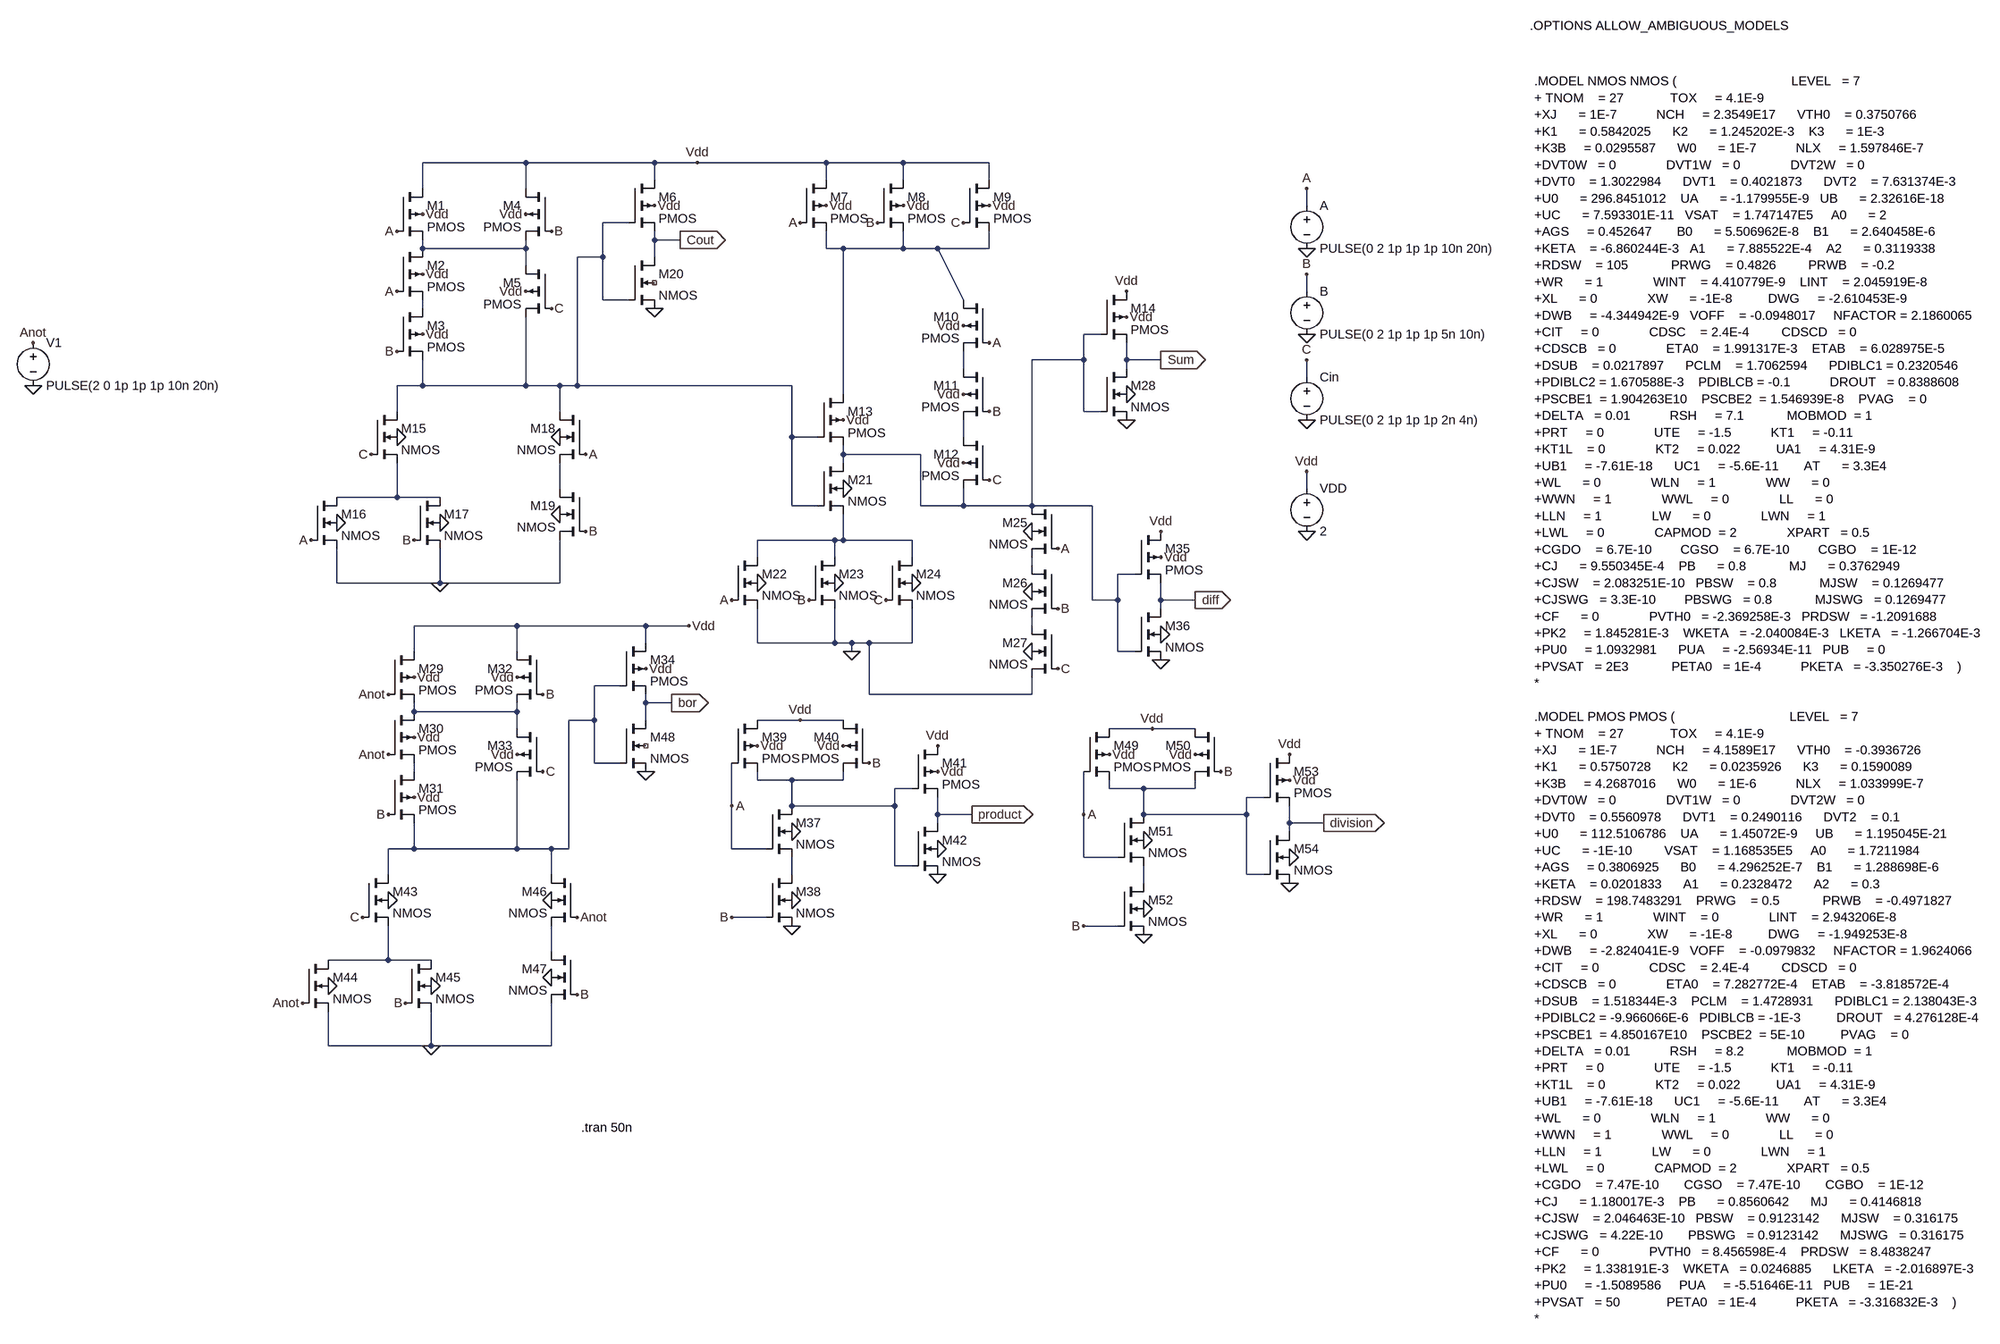
[diagram p0: schematic VLSIProjectfinal.asc]
VLSIProjectfinal.asc, the LTspice schematic file:
Version 4.1
SHEET 1 5960 2140
WIRE 224 -32 32 -32
WIRE 464 -32 224 -32
WIRE 544 -32 464 -32
WIRE 784 -32 544 -32
WIRE 928 -32 784 -32
WIRE 1088 -32 928 -32
WIRE 464 0 464 -32
WIRE 784 0 784 -32
WIRE 928 0 928 -32
WIRE 1088 0 1088 -32
WIRE 32 16 32 -32
WIRE 224 16 224 -32
WIRE 1680 48 1680 16
WIRE 416 80 368 80
WIRE 464 112 464 96
WIRE 512 112 464 112
WIRE 32 128 32 112
WIRE 224 128 224 112
WIRE 224 128 32 128
WIRE 784 128 784 96
WIRE 816 128 784 128
WIRE 928 128 928 96
WIRE 928 128 816 128
WIRE 992 128 928 128
WIRE 1088 128 1088 96
WIRE 1088 128 992 128
WIRE 368 144 368 80
WIRE 368 144 320 144
WIRE 464 144 464 112
WIRE 224 160 224 128
WIRE 1680 208 1680 176
WIRE 368 224 368 144
WIRE 416 224 368 224
WIRE 1040 224 992 128
WIRE 32 240 32 224
WIRE 1296 288 1264 288
WIRE 1264 336 1264 288
WIRE 1264 336 1168 336
WIRE 1344 336 1344 304
WIRE 1408 336 1344 336
WIRE 1040 352 1040 320
WIRE 1344 352 1344 336
WIRE 1680 368 1680 336
WIRE 32 384 32 336
WIRE 32 384 -16 384
WIRE 224 384 224 256
WIRE 224 384 32 384
WIRE 288 384 224 384
WIRE 320 384 320 144
WIRE 320 384 288 384
WIRE 720 384 320 384
WIRE 816 400 816 128
WIRE -16 432 -16 384
WIRE 288 432 288 384
WIRE 1264 432 1264 336
WIRE 1296 432 1264 432
WIRE 720 480 720 384
WIRE 768 480 720 480
WIRE 1040 480 1040 448
WIRE 816 512 816 496
WIRE 960 512 816 512
WIRE 816 528 816 512
WIRE 288 576 288 528
WIRE 1680 576 1680 544
WIRE -16 592 -16 528
WIRE -16 592 -128 592
WIRE 64 592 -16 592
WIRE 720 608 720 480
WIRE 768 608 720 608
WIRE 960 608 960 512
WIRE 1040 608 1040 576
WIRE 1040 608 960 608
WIRE 1168 608 1168 336
WIRE 1168 608 1040 608
WIRE 1280 608 1168 608
WIRE 800 672 656 672
WIRE 816 672 816 624
WIRE 816 672 800 672
WIRE 944 672 816 672
WIRE 656 704 656 672
WIRE 800 704 800 672
WIRE 944 704 944 672
WIRE 1168 720 1168 704
WIRE 1360 736 1328 736
WIRE -128 752 -128 688
WIRE 64 752 64 688
WIRE 64 752 -128 752
WIRE 288 752 288 672
WIRE 288 752 64 752
WIRE 1280 784 1280 608
WIRE 1328 784 1328 736
WIRE 1328 784 1280 784
WIRE 1408 784 1408 752
WIRE 1472 784 1408 784
WIRE 1408 800 1408 784
WIRE 208 832 16 832
WIRE 448 832 208 832
WIRE 528 832 448 832
WIRE 1168 832 1168 816
WIRE 448 864 448 832
WIRE 656 864 656 800
WIRE 800 864 800 800
WIRE 800 864 656 864
WIRE 832 864 800 864
WIRE 864 864 832 864
WIRE 944 864 944 800
WIRE 944 864 864 864
WIRE 16 880 16 832
WIRE 208 880 208 832
WIRE 832 880 832 864
WIRE 1328 880 1328 784
WIRE 1360 880 1328 880
WIRE 400 944 352 944
WIRE 864 960 864 864
WIRE 1168 960 1168 928
WIRE 1168 960 864 960
WIRE 448 976 448 960
WIRE 496 976 448 976
WIRE 16 992 16 976
WIRE 208 992 208 976
WIRE 208 992 16 992
WIRE 352 1008 352 944
WIRE 352 1008 304 1008
WIRE 448 1008 448 976
WIRE 736 1008 656 1008
WIRE 816 1008 736 1008
WIRE 208 1024 208 992
WIRE 1392 1024 1312 1024
WIRE 1472 1024 1392 1024
WIRE 352 1088 352 1008
WIRE 400 1088 352 1088
WIRE 16 1104 16 1088
WIRE 656 1120 656 1104
WIRE 720 1120 656 1120
WIRE 816 1120 816 1104
WIRE 816 1120 720 1120
WIRE 944 1136 912 1136
WIRE 1312 1136 1312 1120
WIRE 1376 1136 1312 1136
WIRE 1472 1136 1472 1120
WIRE 1472 1136 1376 1136
WIRE 1600 1152 1568 1152
WIRE 608 1168 608 1088
WIRE 720 1168 720 1120
WIRE 912 1168 912 1136
WIRE 912 1168 720 1168
WIRE 992 1184 992 1152
WIRE 1056 1184 992 1184
WIRE 1264 1184 1264 1104
WIRE 1376 1184 1376 1136
WIRE 1568 1184 1568 1152
WIRE 1568 1184 1376 1184
WIRE 992 1200 992 1184
WIRE 1648 1200 1648 1168
WIRE 1712 1200 1648 1200
WIRE 1648 1216 1648 1200
WIRE 16 1248 16 1200
WIRE 16 1248 -32 1248
WIRE 208 1248 208 1120
WIRE 208 1248 16 1248
WIRE 272 1248 208 1248
WIRE 304 1248 304 1008
WIRE 304 1248 272 1248
WIRE 608 1248 608 1168
WIRE 672 1248 608 1248
WIRE 1264 1264 1264 1184
WIRE 1328 1264 1264 1264
WIRE 912 1280 912 1168
WIRE 944 1280 912 1280
WIRE -32 1296 -32 1248
WIRE 272 1296 272 1248
WIRE 720 1296 720 1264
WIRE 1568 1296 1568 1184
WIRE 1600 1296 1568 1296
WIRE 1376 1312 1376 1280
WIRE 672 1376 608 1376
WIRE 1328 1392 1264 1392
WIRE 272 1440 272 1392
WIRE -32 1456 -32 1392
WIRE -32 1456 -144 1456
WIRE 48 1456 -32 1456
WIRE -144 1616 -144 1552
WIRE 48 1616 48 1552
WIRE 48 1616 -144 1616
WIRE 272 1616 272 1536
WIRE 272 1616 48 1616
FLAG 1344 448 0
FLAG 64 752 0
FLAG 464 240 0
FLAG 832 880 0
FLAG 1680 128 0
FLAG 1680 288 0
FLAG 1680 448 0
FLAG 1680 656 0
FLAG 1680 544 Vdd
FLAG 544 -32 Vdd
FLAG 1344 208 Vdd
FLAG 32 64 Vdd
FLAG 224 64 Vdd
FLAG 32 176 Vdd
FLAG 224 208 Vdd
FLAG 32 288 Vdd
FLAG 464 48 Vdd
FLAG 784 48 Vdd
FLAG 928 48 Vdd
FLAG 1088 48 Vdd
FLAG 1040 272 Vdd
FLAG 1040 400 Vdd
FLAG 816 448 Vdd
FLAG 1040 528 Vdd
FLAG 1344 256 Vdd
FLAG 1680 16 A
FLAG -16 96 A
FLAG -16 208 A
FLAG -176 672 A
FLAG 336 512 A
FLAG 736 80 A
FLAG 1088 304 A
FLAG 608 784 A
FLAG 1216 688 A
FLAG 1680 176 B
FLAG -16 320 B
FLAG 272 96 B
FLAG 16 672 B
FLAG 336 656 B
FLAG 880 80 B
FLAG 1088 432 B
FLAG 752 784 B
FLAG 1216 800 B
FLAG 1680 336 C
FLAG -64 512 C
FLAG 272 240 C
FLAG 1040 80 C
FLAG 1088 560 C
FLAG 896 784 C
FLAG 1216 912 C
FLAG 1408 336 Sum
IOPIN 1408 336 Out
FLAG 512 112 Cout
IOPIN 512 112 Out
FLAG -16 480 0
FLAG 288 480 0
FLAG -128 640 0
FLAG 64 640 0
FLAG 288 624 0
FLAG 816 576 0
FLAG 656 752 0
FLAG 800 752 0
FLAG 944 752 0
FLAG 1168 656 0
FLAG 1168 880 0
FLAG 1168 768 0
FLAG 1344 400 0
FLAG -704 384 0
FLAG -704 304 Anot
FLAG 48 1616 0
FLAG 448 1104 0
FLAG 528 832 Vdd
FLAG 16 928 Vdd
FLAG 208 928 Vdd
FLAG 16 1040 Vdd
FLAG 208 1072 Vdd
FLAG 16 1152 Vdd
FLAG 448 912 Vdd
FLAG -32 1184 B
FLAG 256 960 B
FLAG 0 1536 B
FLAG 320 1520 B
FLAG -80 1376 C
FLAG 256 1104 C
FLAG 496 976 bor
IOPIN 496 976 Out
FLAG -32 1344 0
FLAG 272 1344 0
FLAG -144 1504 0
FLAG 48 1504 0
FLAG 272 1488 0
FLAG -32 960 Anot
FLAG -32 1072 Anot
FLAG -192 1536 Anot
FLAG 320 1376 Anot
FLAG 1408 896 0
FLAG 1408 656 Vdd
FLAG 1408 704 Vdd
FLAG 1472 784 diff
IOPIN 1472 784 Out
FLAG 1408 848 0
FLAG 720 1392 0
FLAG 736 1008 Vdd
FLAG 720 1216 0
FLAG 720 1344 0
FLAG 656 1056 Vdd
FLAG 816 1056 Vdd
FLAG 608 1376 B
FLAG 864 1088 B
FLAG 608 1168 A
FLAG 992 1296 0
FLAG 992 1056 Vdd
FLAG 992 1104 Vdd
FLAG 1056 1184 product
IOPIN 1056 1184 Out
FLAG 992 1248 0
FLAG 1376 1408 0
FLAG 1392 1024 Vdd
FLAG 1376 1232 0
FLAG 1376 1360 0
FLAG 1312 1072 Vdd
FLAG 1472 1072 Vdd
FLAG 1264 1392 B
FLAG 1520 1104 B
FLAG 1264 1184 A
FLAG 1648 1312 0
FLAG 1648 1072 Vdd
FLAG 1648 1120 Vdd
FLAG 1712 1200 division
IOPIN 1712 1200 Out
FLAG 1648 1264 0
SYMBOL pmos4 -16 16 R0
SYMATTR InstName M1
SYMATTR Value2 l=180n w=180n
SYMBOL pmos4 -16 128 R0
SYMATTR InstName M2
SYMATTR Value2 l=180n w=180n
SYMBOL pmos4 -16 240 R0
SYMATTR InstName M3
SYMATTR Value2 l=180n w=180n
SYMBOL pmos4 272 16 M0
SYMATTR InstName M4
SYMATTR Value2 l=180n w=180n
SYMBOL pmos4 272 160 M0
SYMATTR InstName M5
SYMATTR Value2 l=180n w=180n
SYMBOL pmos4 416 0 R0
SYMATTR InstName M6
SYMATTR Value2 l=180n w=180n
SYMBOL pmos4 736 0 R0
SYMATTR InstName M7
SYMATTR Value2 l=180n w=180n
SYMBOL pmos4 880 0 R0
SYMATTR InstName M8
SYMATTR Value2 l=180n w=180n
SYMBOL pmos4 1040 0 R0
SYMATTR InstName M9
SYMATTR Value2 l=180n w=180n
SYMBOL pmos4 1088 224 M0
SYMATTR InstName M10
SYMATTR Value2 l=180n w=180n
SYMBOL pmos4 1088 352 M0
SYMATTR InstName M11
SYMATTR Value2 l=180n w=180n
SYMBOL pmos4 1088 480 M0
SYMATTR InstName M12
SYMATTR Value2 l=180n w=180n
SYMBOL pmos4 768 400 R0
SYMATTR InstName M13
SYMATTR Value2 l=180n w=180n
SYMBOL pmos4 1296 208 R0
SYMATTR InstName M14
SYMATTR Value2 l=180n w=180n
SYMBOL nmos4 -64 432 R0
SYMATTR InstName M15
SYMATTR Value2 l=180n w=180n
SYMBOL nmos4 -176 592 R0
SYMATTR InstName M16
SYMATTR Value2 l=180n w=180n
SYMBOL nmos4 16 592 R0
SYMATTR InstName M17
SYMATTR Value2 l=180n w=180n
SYMBOL nmos4 336 432 M0
SYMATTR InstName M18
SYMATTR Value2 l=180n w=180n
SYMBOL nmos4 336 576 M0
SYMATTR InstName M19
SYMATTR Value2 l=180n w=180n
SYMBOL nmos4 416 144 R0
SYMATTR InstName M20
SYMATTR Value2 l=180n w=180n
SYMBOL nmos4 768 528 R0
SYMATTR InstName M21
SYMATTR Value2 l=180n w=180n
SYMBOL nmos4 608 704 R0
SYMATTR InstName M22
SYMATTR Value2 l=180n w=180n
SYMBOL nmos4 752 704 R0
SYMATTR InstName M23
SYMATTR Value2 l=180n w=180n
SYMBOL nmos4 896 704 R0
SYMATTR InstName M24
SYMATTR Value2 l=180n w=180n
SYMBOL nmos4 1216 608 M0
SYMATTR InstName M25
SYMATTR Value2 l=180n w=180n
SYMBOL nmos4 1216 720 M0
SYMATTR InstName M26
SYMATTR Value2 l=180n w=180n
SYMBOL nmos4 1216 832 M0
SYMATTR InstName M27
SYMATTR Value2 l=180n w=180n
SYMBOL nmos4 1296 352 R0
SYMATTR InstName M28
SYMATTR Value2 l=180n w=180n
SYMBOL voltage 1680 32 R0
WINDOW 123 0 0 Left 0
WINDOW 39 0 0 Left 0
SYMATTR InstName A
SYMATTR Value PULSE(0 2 1p 1p 1p 10n 20n)
SYMBOL voltage 1680 192 R0
WINDOW 123 0 0 Left 0
WINDOW 39 0 0 Left 0
SYMATTR InstName B
SYMATTR Value PULSE(0 2 1p 1p 1p 5n 10n)
SYMBOL voltage 1680 352 R0
WINDOW 123 0 0 Left 0
WINDOW 39 0 0 Left 0
SYMATTR InstName Cin
SYMATTR Value PULSE(0 2 1p 1p 1p 2n 4n)
SYMBOL voltage 1680 560 R0
WINDOW 123 0 0 Left 0
WINDOW 39 0 0 Left 0
SYMATTR InstName VDD
SYMATTR Value 2
SYMBOL voltage -704 288 R0
WINDOW 123 0 0 Left 0
WINDOW 39 0 0 Left 0
SYMATTR InstName V1
SYMATTR Value PULSE(2 0 1p 1p 1p 10n 20n)
SYMBOL pmos4 -32 880 R0
SYMATTR InstName M29
SYMATTR Value2 l=180n w=180n
SYMBOL pmos4 -32 992 R0
SYMATTR InstName M30
SYMATTR Value2 l=180n w=180n
SYMBOL pmos4 -32 1104 R0
SYMATTR InstName M31
SYMATTR Value2 l=180n w=180n
SYMBOL pmos4 256 880 M0
SYMATTR InstName M32
SYMATTR Value2 l=180n w=180n
SYMBOL pmos4 256 1024 M0
SYMATTR InstName M33
SYMATTR Value2 l=180n w=180n
SYMBOL pmos4 400 864 R0
SYMATTR InstName M34
SYMATTR Value2 l=180n w=180n
SYMBOL nmos4 -80 1296 R0
SYMATTR InstName M43
SYMATTR Value2 l=180n w=180n
SYMBOL nmos4 -192 1456 R0
SYMATTR InstName M44
SYMATTR Value2 l=180n w=180n
SYMBOL nmos4 0 1456 R0
SYMATTR InstName M45
SYMATTR Value2 l=180n w=180n
SYMBOL nmos4 320 1296 M0
SYMATTR InstName M46
SYMATTR Value2 l=180n w=180n
SYMBOL nmos4 320 1440 M0
SYMATTR InstName M47
SYMATTR Value2 l=180n w=180n
SYMBOL nmos4 400 1008 R0
SYMATTR InstName M48
SYMATTR Value2 l=180n w=180n
SYMBOL pmos4 1360 656 R0
SYMATTR InstName M35
SYMATTR Value2 l=180n w=180n
SYMBOL nmos4 1360 800 R0
SYMATTR InstName M36
SYMATTR Value2 l=180n w=180n
SYMBOL pmos4 608 1008 R0
SYMATTR InstName M39
SYMATTR Value2 l=180n w=180n
SYMBOL pmos4 864 1008 M0
SYMATTR InstName M40
SYMATTR Value2 l=180n w=180n
SYMBOL nmos4 672 1168 R0
SYMATTR InstName M37
SYMATTR Value2 l=180n w=180n
SYMBOL nmos4 672 1296 R0
SYMATTR InstName M38
SYMATTR Value2 l=180n w=180n
SYMBOL pmos4 944 1056 R0
SYMATTR InstName M41
SYMATTR Value2 l=180n w=180n
SYMBOL nmos4 944 1200 R0
SYMATTR InstName M42
SYMATTR Value2 l=180n w=180n
SYMBOL pmos4 1264 1024 R0
SYMATTR InstName M49
SYMATTR Value2 l=180n w=180n
SYMBOL pmos4 1520 1024 M0
SYMATTR InstName M50
SYMATTR Value2 l=180n w=180n
SYMBOL nmos4 1328 1184 R0
SYMATTR InstName M51
SYMATTR Value2 l=180n w=180n
SYMBOL nmos4 1328 1312 R0
SYMATTR InstName M52
SYMATTR Value2 l=180n w=180n
SYMBOL pmos4 1600 1072 R0
SYMATTR InstName M53
SYMATTR Value2 l=180n w=180n
SYMBOL nmos4 1600 1216 R0
SYMATTR InstName M54
SYMATTR Value2 l=180n w=180n
TEXT 2104 -184 Left 2 !.MODEL NMOS NMOS (                                LEVEL   = 7\n+ TNOM    = 27             TOX     = 4.1E-9  \n+XJ      = 1E-7           NCH     = 2.3549E17      VTH0    = 0.3750766\n+K1      = 0.5842025      K2      = 1.245202E-3    K3      = 1E-3\n+K3B     = 0.0295587      W0      = 1E-7           NLX     = 1.597846E-7\n+DVT0W   = 0              DVT1W   = 0              DVT2W   = 0\n+DVT0    = 1.3022984      DVT1    = 0.4021873      DVT2    = 7.631374E-3\n+U0      = 296.8451012    UA      = -1.179955E-9   UB      = 2.32616E-18\n+UC      = 7.593301E-11   VSAT    = 1.747147E5     A0      = 2\n+AGS     = 0.452647       B0      = 5.506962E-8    B1      = 2.640458E-6\n+KETA    = -6.860244E-3   A1      = 7.885522E-4    A2      = 0.3119338\n+RDSW    = 105            PRWG    = 0.4826         PRWB    = -0.2\n+WR      = 1              WINT    = 4.410779E-9    LINT    = 2.045919E-8\n+XL      = 0              XW      = -1E-8          DWG     = -2.610453E-9\n+DWB     = -4.344942E-9   VOFF    = -0.0948017     NFACTOR = 2.1860065\n+CIT     = 0              CDSC    = 2.4E-4         CDSCD   = 0\n+CDSCB   = 0              ETA0    = 1.991317E-3    ETAB    = 6.028975E-5\n+DSUB    = 0.0217897      PCLM    = 1.7062594      PDIBLC1 = 0.2320546\n+PDIBLC2 = 1.670588E-3    PDIBLCB = -0.1           DROUT   = 0.8388608\n+PSCBE1  = 1.904263E10    PSCBE2  = 1.546939E-8    PVAG    = 0\n+DELTA   = 0.01           RSH     = 7.1            MOBMOD  = 1\n+PRT     = 0              UTE     = -1.5           KT1     = -0.11\n+KT1L    = 0              KT2     = 0.022          UA1     = 4.31E-9\n+UB1     = -7.61E-18      UC1     = -5.6E-11       AT      = 3.3E4\n+WL      = 0              WLN     = 1              WW      = 0\n+WWN     = 1              WWL     = 0              LL      = 0\n+LLN     = 1              LW      = 0              LWN     = 1\n+LWL     = 0              CAPMOD  = 2              XPART   = 0.5\n+CGDO    = 6.7E-10        CGSO    = 6.7E-10        CGBO    = 1E-12\n+CJ      = 9.550345E-4    PB      = 0.8            MJ      = 0.3762949\n+CJSW    = 2.083251E-10   PBSW    = 0.8            MJSW    = 0.1269477\n+CJSWG   = 3.3E-10        PBSWG   = 0.8            MJSWG   = 0.1269477\n+CF      = 0              PVTH0   = -2.369258E-3   PRDSW   = -1.2091688\n+PK2     = 1.845281E-3    WKETA   = -2.040084E-3   LKETA   = -1.266704E-3\n+PU0     = 1.0932981      PUA     = -2.56934E-11   PUB     = 0\n+PVSAT   = 2E3            PETA0   = 1E-4           PKETA   = -3.350276E-3    )\n*\n \n.MODEL PMOS PMOS (                                LEVEL   = 7\n+ TNOM    = 27             TOX     = 4.1E-9\n+XJ      = 1E-7           NCH     = 4.1589E17      VTH0    = -0.3936726\n+K1      = 0.5750728      K2      = 0.0235926      K3      = 0.1590089\n+K3B     = 4.2687016      W0      = 1E-6           NLX     = 1.033999E-7\n+DVT0W   = 0              DVT1W   = 0              DVT2W   = 0\n+DVT0    = 0.5560978      DVT1    = 0.2490116      DVT2    = 0.1\n+U0      = 112.5106786    UA      = 1.45072E-9     UB      = 1.195045E-21\n+UC      = -1E-10         VSAT    = 1.168535E5     A0      = 1.7211984\n+AGS     = 0.3806925      B0      = 4.296252E-7    B1      = 1.288698E-6\n+KETA    = 0.0201833      A1      = 0.2328472      A2      = 0.3\n+RDSW    = 198.7483291    PRWG    = 0.5            PRWB    = -0.4971827\n+WR      = 1              WINT    = 0              LINT    = 2.943206E-8\n+XL      = 0              XW      = -1E-8          DWG     = -1.949253E-8\n+DWB     = -2.824041E-9   VOFF    = -0.0979832     NFACTOR = 1.9624066\n+CIT     = 0              CDSC    = 2.4E-4         CDSCD   = 0\n+CDSCB   = 0              ETA0    = 7.282772E-4    ETAB    = -3.818572E-4\n+DSUB    = 1.518344E-3    PCLM    = 1.4728931      PDIBLC1 = 2.138043E-3\n+PDIBLC2 = -9.966066E-6   PDIBLCB = -1E-3          DROUT   = 4.276128E-4\n+PSCBE1  = 4.850167E10    PSCBE2  = 5E-10          PVAG    = 0\n+DELTA   = 0.01           RSH     = 8.2            MOBMOD  = 1\n+PRT     = 0              UTE     = -1.5           KT1     = -0.11\n+KT1L    = 0              KT2     = 0.022          UA1     = 4.31E-9\n+UB1     = -7.61E-18      UC1     = -5.6E-11       AT      = 3.3E4\n+WL      = 0              WLN     = 1              WW      = 0\n+WWN     = 1              WWL     = 0              LL      = 0\n+LLN     = 1              LW      = 0              LWN     = 1\n+LWL     = 0              CAPMOD  = 2              XPART   = 0.5\n+CGDO    = 7.47E-10       CGSO    = 7.47E-10       CGBO    = 1E-12\n+CJ      = 1.180017E-3    PB      = 0.8560642      MJ      = 0.4146818\n+CJSW    = 2.046463E-10   PBSW    = 0.9123142      MJSW    = 0.316175\n+CJSWG   = 4.22E-10       PBSWG   = 0.9123142      MJSWG   = 0.316175\n+CF      = 0              PVTH0   = 8.456598E-4    PRDSW   = 8.4838247\n+PK2     = 1.338191E-3    WKETA   = 0.0246885      LKETA   = -2.016897E-3\n+PU0     = -1.5089586     PUA     = -5.51646E-11   PUB     = 1E-21\n+PVSAT   = 50             PETA0   = 1E-4           PKETA   = -3.316832E-3    )\n*
TEXT 2096 -288 Left 2 !.OPTIONS ALLOW_AMBIGUOUS_MODELS
TEXT 328 1768 Left 2 !.tran 50n

The netlist it stands for:
* VLSIProjectfinal.asc
M1 Vdd A N002 Vdd PMOS l=180n w=180n
M2 N002 A N004 Vdd PMOS l=180n w=180n
M3 N004 B N001 Vdd PMOS l=180n w=180n
M4 Vdd B N002 Vdd PMOS l=180n w=180n
M5 N002 C N001 Vdd PMOS l=180n w=180n
M6 Vdd N001 Cout Vdd PMOS l=180n w=180n
M7 Vdd A N003 Vdd PMOS l=180n w=180n
M8 Vdd B N003 Vdd PMOS l=180n w=180n
M9 Vdd C N003 Vdd PMOS l=180n w=180n
M10 N003 A N006 Vdd PMOS l=180n w=180n
M11 N006 B N007 Vdd PMOS l=180n w=180n
M12 N007 C N005 Vdd PMOS l=180n w=180n
M13 N003 N001 N005 Vdd PMOS l=180n w=180n
M14 Vdd N005 Sum Vdd PMOS l=180n w=180n
M15 N001 C N009 0 NMOS l=180n w=180n
M16 N009 A 0 0 NMOS l=180n w=180n
M17 N009 B 0 0 NMOS l=180n w=180n
M18 N001 A N008 0 NMOS l=180n w=180n
M19 N008 B 0 0 NMOS l=180n w=180n
M20 Cout N001 0 NC_01 NMOS l=180n w=180n
M21 N005 N001 N010 0 NMOS l=180n w=180n
M22 N010 A 0 0 NMOS l=180n w=180n
M23 N010 B 0 0 NMOS l=180n w=180n
M24 N010 C 0 0 NMOS l=180n w=180n
M25 N005 A N011 0 NMOS l=180n w=180n
M26 N011 B N012 0 NMOS l=180n w=180n
M27 N012 C 0 0 NMOS l=180n w=180n
M28 Sum N005 0 0 NMOS l=180n w=180n
V§A A 0 PULSE(0 2 1p 1p 1p 10n 20n)
V§B B 0 PULSE(0 2 1p 1p 1p 5n 10n)
V§Cin C 0 PULSE(0 2 1p 1p 1p 2n 4n)
VDD Vdd 0 2
V1 Anot 0 PULSE(2 0 1p 1p 1p 10n 20n)
M29 Vdd Anot N014 Vdd PMOS l=180n w=180n
M30 N014 Anot N015 Vdd PMOS l=180n w=180n
M31 N015 B N013 Vdd PMOS l=180n w=180n
M32 Vdd B N014 Vdd PMOS l=180n w=180n
M33 N014 C N013 Vdd PMOS l=180n w=180n
M34 Vdd N013 bor Vdd PMOS l=180n w=180n
M43 N013 C N021 0 NMOS l=180n w=180n
M44 N021 Anot 0 0 NMOS l=180n w=180n
M45 N021 B 0 0 NMOS l=180n w=180n
M46 N013 Anot N020 0 NMOS l=180n w=180n
M47 N020 B 0 0 NMOS l=180n w=180n
M48 bor N013 0 NC_02 NMOS l=180n w=180n
M35 Vdd N005 diff Vdd PMOS l=180n w=180n
M36 diff N005 0 0 NMOS l=180n w=180n
M39 Vdd A N016 Vdd PMOS l=180n w=180n
M40 Vdd B N016 Vdd PMOS l=180n w=180n
M37 N016 A N018 0 NMOS l=180n w=180n
M38 N018 B 0 0 NMOS l=180n w=180n
M41 Vdd N016 product Vdd PMOS l=180n w=180n
M42 product N016 0 0 NMOS l=180n w=180n
M49 Vdd A N017 Vdd PMOS l=180n w=180n
M50 Vdd B N017 Vdd PMOS l=180n w=180n
M51 N017 A N019 0 NMOS l=180n w=180n
M52 N019 B 0 0 NMOS l=180n w=180n
M53 Vdd N017 division Vdd PMOS l=180n w=180n
M54 division N017 0 0 NMOS l=180n w=180n
.model NMOS NMOS
.model PMOS PMOS
.lib standard.mos
.MODEL NMOS NMOS (                                LEVEL   = 7
+ TNOM    = 27             TOX     = 4.1E-9
+XJ      = 1E-7           NCH     = 2.3549E17      VTH0    = 0.3750766
+K1      = 0.5842025      K2      = 1.245202E-3    K3      = 1E-3
+K3B     = 0.0295587      W0      = 1E-7           NLX     = 1.597846E-7
+DVT0W   = 0              DVT1W   = 0              DVT2W   = 0
+DVT0    = 1.3022984      DVT1    = 0.4021873      DVT2    = 7.631374E-3
+U0      = 296.8451012    UA      = -1.179955E-9   UB      = 2.32616E-18
+UC      = 7.593301E-11   VSAT    = 1.747147E5     A0      = 2
+AGS     = 0.452647       B0      = 5.506962E-8    B1      = 2.640458E-6
+KETA    = -6.860244E-3   A1      = 7.885522E-4    A2      = 0.3119338
+RDSW    = 105            PRWG    = 0.4826         PRWB    = -0.2
+WR      = 1              WINT    = 4.410779E-9    LINT    = 2.045919E-8
+XL      = 0              XW      = -1E-8          DWG     = -2.610453E-9
+DWB     = -4.344942E-9   VOFF    = -0.0948017     NFACTOR = 2.1860065
+CIT     = 0              CDSC    = 2.4E-4         CDSCD   = 0
+CDSCB   = 0              ETA0    = 1.991317E-3    ETAB    = 6.028975E-5
+DSUB    = 0.0217897      PCLM    = 1.7062594      PDIBLC1 = 0.2320546
+PDIBLC2 = 1.670588E-3    PDIBLCB = -0.1           DROUT   = 0.8388608
+PSCBE1  = 1.904263E10    PSCBE2  = 1.546939E-8    PVAG    = 0
+DELTA   = 0.01           RSH     = 7.1            MOBMOD  = 1
+PRT     = 0              UTE     = -1.5           KT1     = -0.11
+KT1L    = 0              KT2     = 0.022          UA1     = 4.31E-9
+UB1     = -7.61E-18      UC1     = -5.6E-11       AT      = 3.3E4
+WL      = 0              WLN     = 1              WW      = 0
+WWN     = 1              WWL     = 0              LL      = 0
+LLN     = 1              LW      = 0              LWN     = 1
+LWL     = 0              CAPMOD  = 2              XPART   = 0.5
+CGDO    = 6.7E-10        CGSO    = 6.7E-10        CGBO    = 1E-12
+CJ      = 9.550345E-4    PB      = 0.8            MJ      = 0.3762949
+CJSW    = 2.083251E-10   PBSW    = 0.8            MJSW    = 0.1269477
+CJSWG   = 3.3E-10        PBSWG   = 0.8            MJSWG   = 0.1269477
+CF      = 0              PVTH0   = -2.369258E-3   PRDSW   = -1.2091688
+PK2     = 1.845281E-3    WKETA   = -2.040084E-3   LKETA   = -1.266704E-3
+PU0     = 1.0932981      PUA     = -2.56934E-11   PUB     = 0
+PVSAT   = 2E3            PETA0   = 1E-4           PKETA   = -3.350276E-3    )
*
.MODEL PMOS PMOS (                                LEVEL   = 7
+ TNOM    = 27             TOX     = 4.1E-9
+XJ      = 1E-7           NCH     = 4.1589E17      VTH0    = -0.3936726
+K1      = 0.5750728      K2      = 0.0235926      K3      = 0.1590089
+K3B     = 4.2687016      W0      = 1E-6           NLX     = 1.033999E-7
+DVT0W   = 0              DVT1W   = 0              DVT2W   = 0
+DVT0    = 0.5560978      DVT1    = 0.2490116      DVT2    = 0.1
+U0      = 112.5106786    UA      = 1.45072E-9     UB      = 1.195045E-21
+UC      = -1E-10         VSAT    = 1.168535E5     A0      = 1.7211984
+AGS     = 0.3806925      B0      = 4.296252E-7    B1      = 1.288698E-6
+KETA    = 0.0201833      A1      = 0.2328472      A2      = 0.3
+RDSW    = 198.7483291    PRWG    = 0.5            PRWB    = -0.4971827
+WR      = 1              WINT    = 0              LINT    = 2.943206E-8
+XL      = 0              XW      = -1E-8          DWG     = -1.949253E-8
+DWB     = -2.824041E-9   VOFF    = -0.0979832     NFACTOR = 1.9624066
+CIT     = 0              CDSC    = 2.4E-4         CDSCD   = 0
+CDSCB   = 0              ETA0    = 7.282772E-4    ETAB    = -3.818572E-4
+DSUB    = 1.518344E-3    PCLM    = 1.4728931      PDIBLC1 = 2.138043E-3
+PDIBLC2 = -9.966066E-6   PDIBLCB = -1E-3          DROUT   = 4.276128E-4
+PSCBE1  = 4.850167E10    PSCBE2  = 5E-10          PVAG    = 0
+DELTA   = 0.01           RSH     = 8.2            MOBMOD  = 1
+PRT     = 0              UTE     = -1.5           KT1     = -0.11
+KT1L    = 0              KT2     = 0.022          UA1     = 4.31E-9
+UB1     = -7.61E-18      UC1     = -5.6E-11       AT      = 3.3E4
+WL      = 0              WLN     = 1              WW      = 0
+WWN     = 1              WWL     = 0              LL      = 0
+LLN     = 1              LW      = 0              LWN     = 1
+LWL     = 0              CAPMOD  = 2              XPART   = 0.5
+CGDO    = 7.47E-10       CGSO    = 7.47E-10       CGBO    = 1E-12
+CJ      = 1.180017E-3    PB      = 0.8560642      MJ      = 0.4146818
+CJSW    = 2.046463E-10   PBSW    = 0.9123142      MJSW    = 0.316175
+CJSWG   = 4.22E-10       PBSWG   = 0.9123142      MJSWG   = 0.316175
+CF      = 0              PVTH0   = 8.456598E-4    PRDSW   = 8.4838247
+PK2     = 1.338191E-3    WKETA   = 0.0246885      LKETA   = -2.016897E-3
+PU0     = -1.5089586     PUA     = -5.51646E-11   PUB     = 1E-21
+PVSAT   = 50             PETA0   = 1E-4           PKETA   = -3.316832E-3    )
*
.OPTIONS ALLOW_AMBIGUOUS_MODELS
.tran 50n
.backanno
.end